# EAGLE design v6.mainboard.rpizerow (EAGLE 9.5.1)
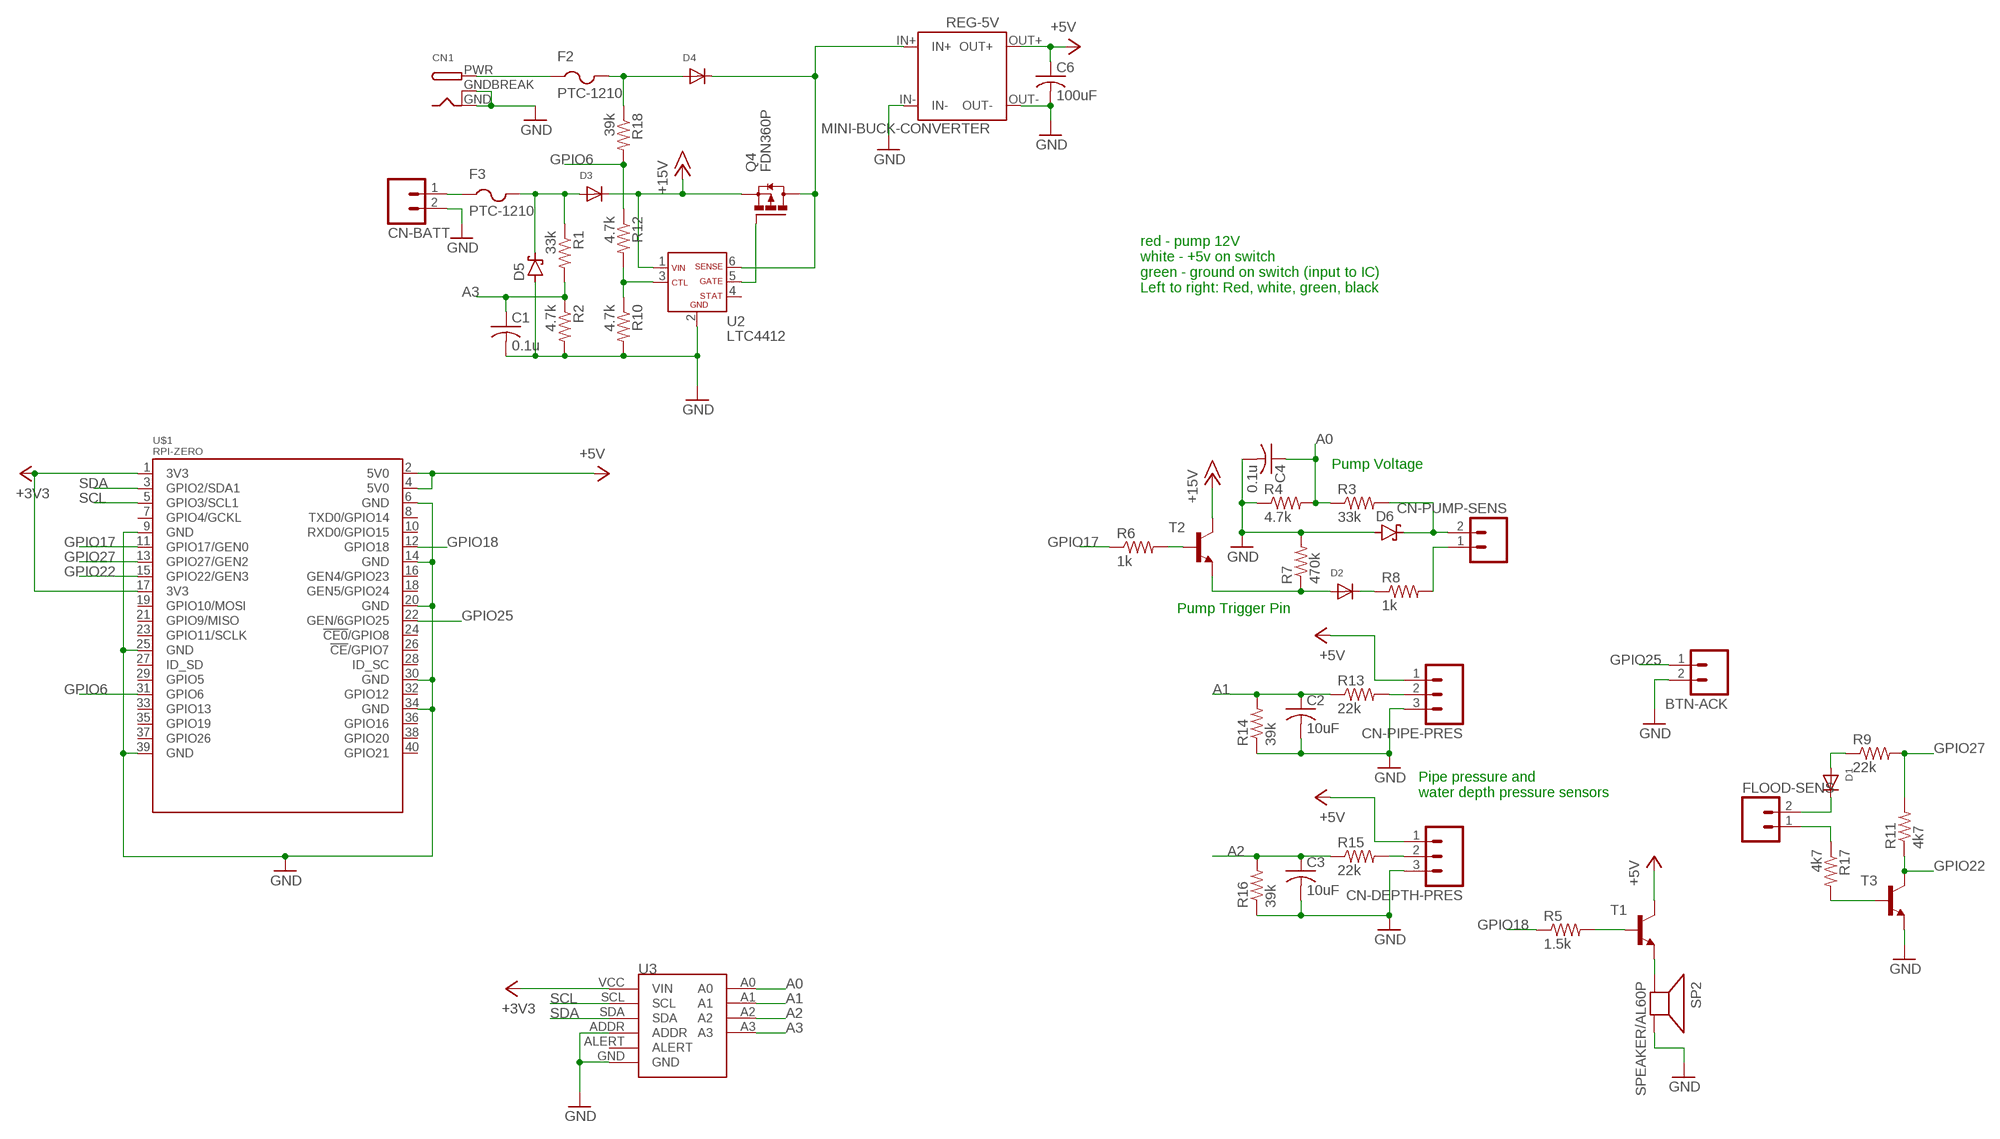
[diagram p0: schematic, sheet 1]

## Parts
BTN-ACK  M02  [02P]
C1  0.1u  C-USC0603K  [C0603K]
C2  10uF  C-USC0805K  [C0805K]
C3  10uF  C-USC0805K  [C0805K]
C4  0.1u  C-USC0603K  [C0603K]
C6  100uF  C-USC2220K  [C2220K]
CN1  DCBARRELPTH  [DCJACK_2MM_PTH]
CN-BATT  M02  [02P]
CN-DEPTH-PRES  M03  [03P]
CN-PIPE-PRES  M03  [03P]
CN-PUMP-SENS  M02  [02P]
D1  DIODESMA  [SMADIODE]
D2  DIODESMA  [SMADIODE]
D3  DIODESMA  [SMADIODE]
D4  DIODESMA  [SMADIODE]
D5  SCHOTTKY-DIODESMC  [SMC]
D6  SCHOTTKY-DIODESMC  [SMC]
F2  PTC-1210  [1210]
F3  PTC-1210  [1210]
FLOOD-SENS  M02  [02P]
Q4  FDN360P  [SUPER-SOT3]
R1  33k  R-US_R0603  [R0603]
R2  4.7k  R-US_R0603  [R0603]
R3  33k  R-US_R0603  [R0603]
R4  4.7k  R-US_R0603  [R0603]
R5  1.5k  R-US_R0603  [R0603]
R6  1k  R-US_R0603  [R0603]
R7  470k  R-US_R0603  [R0603]
R8  1k  R-US_R0603  [R0603]
R9  22k  R-US_R0603  [R0603]
R10  4.7k  R-US_R0603  [R0603]
R11  4k7  R-US_R0603  [R0603]
R12  4.7k  R-US_R0603  [R0603]
R13  22k  R-US_R0603  [R0603]
R14  39k  R-US_R0603  [R0603]
R15  22k  R-US_R0603  [R0603]
R16  39k  R-US_R0603  [R0603]
R17  4k7  R-US_R0603  [R0603]
R18  39k  R-US_R0603  [R0603]
REG-5V  MINI-BUCK-CONVERTER  [MINI-BUCK-CONVERTER]
SP2  SPEAKER/AL60P  [AL60P]
T1  BC808-NPN-SOT23-BEC  [SOT23-BEC]
T2  BC808-NPN-SOT23-BEC  [SOT23-BEC]
T3  BC808-NPN-SOT23-BEC  [SOT23-BEC]
U2  LTC4412  [SOT23-6]
U3  GY-ADS1115THM  [GY-ADS1115-THM]
U$1  RPI-ZERO  [RASPBERRYPI_BASTELSTUBE_V13_RASPI_BOARD_B+_FULL]

## Nets
+3V3: U3.VCC(VIN) U$1.1(3V3) U$1.17(3V3)
+5V: C6.1 CN-DEPTH-PRES.1 CN-PIPE-PRES.1 REG-5V.OUT+ T1.C U$1.2(5V0) U$1.4(5V0)
+15V: D3.C Q4.2(S) T2.C U2.1(VIN)
A0: C4.1 R3.1 R4.2 U3.A0
A1: C2.1 R13.1 R14.2 U3.A1
A2: C3.1 R15.1 R16.2 U3.A2
A3: C1.1 R1.2 R2.1 U3.A3
GND: BTN-ACK.2 C1.2 C2.2 C3.2 C4.2 C6.2 CN1.GND CN1.GNDBREAK CN-BATT.2 CN-DEPTH-PRES.3 CN-PIPE-PRES.3 D5.A D6.A R2.2 R4.1 R7.2 R10.2 R14.1 R16.1 REG-5V.IN- REG-5V.OUT- SP2.2(-) T3.E U2.2(GND) U3.ADDR U3.GND U$1.6(GND) U$1.9(GND) U$1.14(GND) U$1.20(GND) U$1.25(GND) U$1.30(GND) U$1.34(GND) U$1.39(GND)
GPIO6: R12.1 R18.2 U$1.31(GPIO6)
GPIO17: R6.1 U$1.11(GPIO17/GEN0)
GPIO18: R5.1 U$1.12(GPIO18)
GPIO22: R11.1 T3.C U$1.15(GPIO22/GEN3)
GPIO25: BTN-ACK.1 U$1.22(GEN/6GPIO25)
GPIO27: R9.2 R11.2 U$1.13(GPIO27/GEN2)
N$1: Q4.1(G) U2.5(GATE)
N$2: R10.1 R12.2 U2.3(CTL)
N$4: CN-PUMP-SENS.2 D6.C R3.2
N$5: D2.C R8.1
N$6: CN-PUMP-SENS.1 R8.2
N$7: CN-DEPTH-PRES.2 R15.2
N$8: R5.2 T1.B
N$9: SP2.1(+) T1.E
N$10: CN-PIPE-PRES.2 R13.2
N$11: R17.2 T3.B
N$12: R6.2 T2.B
N$13: D3.A D5.C F3.2 R1.1
N$14: D2.A R7.1 T2.E
N$15: CN-BATT.1 F3.1
N$16: D4.C Q4.3(D) REG-5V.IN+ U2.6(SENSE)
N$17: CN1.PWR F2.1
N$18: D4.A F2.2 R18.1
N$19: D1.A R9.1
N$20: FLOOD-SENS.1 R17.1
N$21: D1.C FLOOD-SENS.2
SCL: U3.SCL U$1.5(GPIO3/SCL1)
SDA: U3.SDA U$1.3(GPIO2/SDA1)
Unconnected: U2.4(STAT) U3.ALERT U$1.7(GPIO4/GCKL) U$1.8(TXD0/GPIO14) U$1.10(RXD0/GPIO15) U$1.16(GEN4/GPIO23) U$1.18(GEN5/GPIO24) U$1.19(GPIO10/MOSI) U$1.21(GPIO9/MISO) U$1.23(GPIO11/SCLK) U$1.24(!CE0!/GPIO8) U$1.26(!CE!/GPIO7) U$1.27(ID_SD) U$1.28(ID_SC) U$1.29(GPIO5) U$1.32(GPIO12) U$1.33(GPIO13) U$1.35(GPIO19) U$1.36(GPIO16) U$1.37(GPIO26) U$1.38(GPIO20) U$1.40(GPIO21)

## Notes on the sheet
- red - pump 12V
  white - +5v on switch
  green - ground on switch (input to IC)
  Left to right: Red, white, green, black
- Pump Voltage
- Pump Trigger Pin
- Pipe pressure and 
  water depth pressure sensors

## Library data of the parts
BTN-ACK CN-BATT CN-PUMP-SENS FLOOD-SENS = con-amp-quick:M02: AMP QUICK CONNECTOR; OC_FARNELL: unknown; OC_NEWARK: unknown
C1-C4 C6 = adafruit:C-US: CAPACITOR, American symbol
CN1 = adafruit:DCBARREL: 2.0mm DC Barrel Jack DCJACK_2MM_PTH - Through Hole Jack (4UConnector: 05537)
CN-DEPTH-PRES CN-PIPE-PRES = con-amp-quick:M03: AMP QUICK CONNECTOR; OC_FARNELL: unknown; OC_NEWARK: unknown
D1-D4 = adafruit:DIODE: Diode SMADIODE - SMA Surface Mount Package 20V 1A Schottky Diode Digikey: 641-1014-6-ND DO-1N4148 - Through Hole Small Current Diode SOD-123 20V 1 A (.5mV Vf) Schottky Diode - Digikey: MBRX120TPMSCT-ND SOD-323 10V 570mA (.38mV Vf, 3ns) Schottky Diode - Digikey: ZLLS410CT-ND SOD-523 30V 30mA Schottky Diode (RB751S-40TE61) - Digikey: RB751S-40TE61CT-ND SOT23-R/W - SOT23 Package (R = Solder Paste/Reflow Ovens, W = Hand-Soldering) BAT54Film 40V 300mA - Digikey: 497-7162-1-ND
D5 D6 = diode:SCHOTTKY-DIODE: Schottky Diode
F2 F3 = serge:PTC-1210
Q4 = transistor-power:FDN360P: Single P-Channel, PowerTrench (R) MOSFET Source: http://www.fairchildsemi.com/ds/FD/FDN360P.pdf
R1-R18 = adafruit:R-US_: RESISTOR, American symbol
REG-5V = serge:MINI-BUCK-CONVERTER
SP2 = adafruit:SPEAKER: SPEAKER Source: Buerklin Added PS12 (for part # PS1240 piezo) http://www.ladyada.net/library/pcb/eaglelibrary.html
T1-T3 = transistor:*-NPN-: NPN Transistror BF959 corrected 2008.03.06
U2 = U-LT-LTC4412-ideal-diode:LTC4412
U3 = serge:GY-ADS1115
U$1 = RPI-Zero-wh:RPI-ZERO

## Board
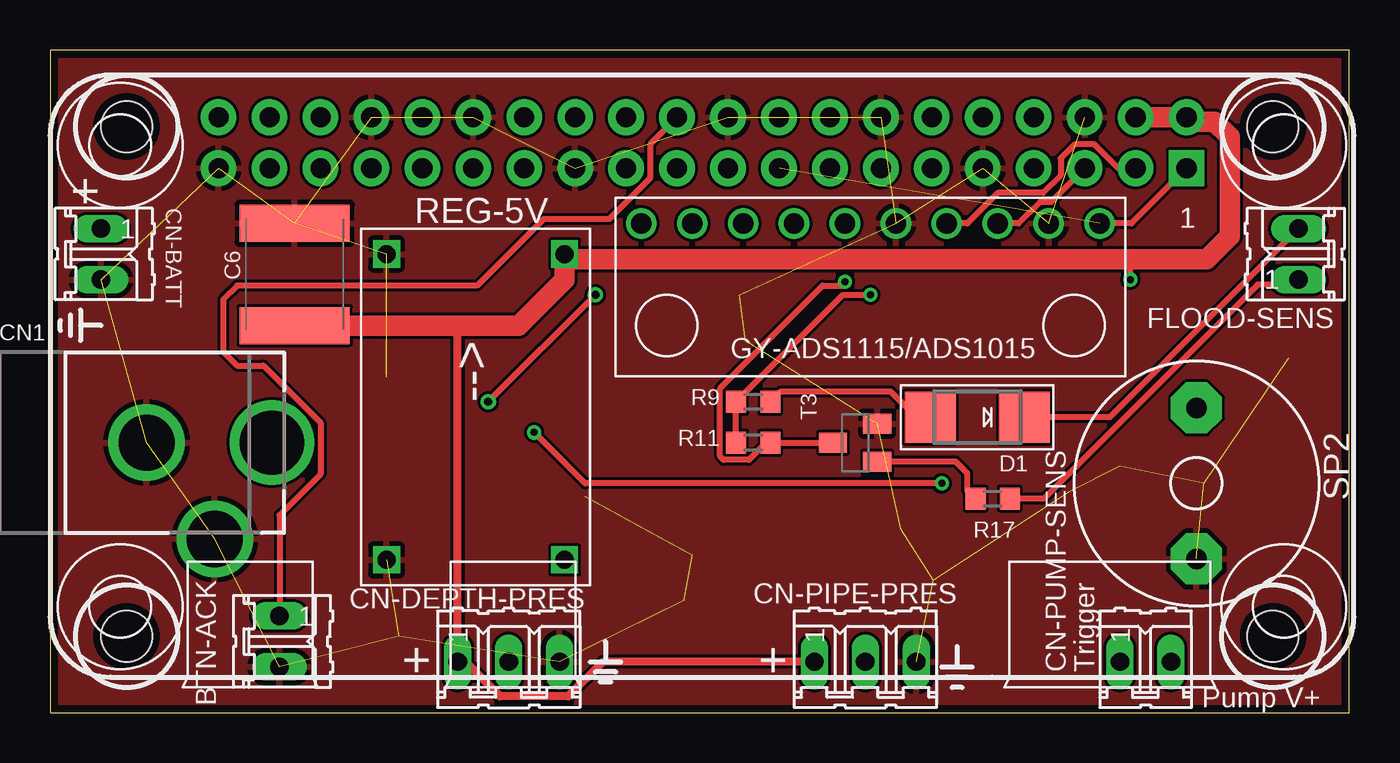
[diagram p1: board, top side]
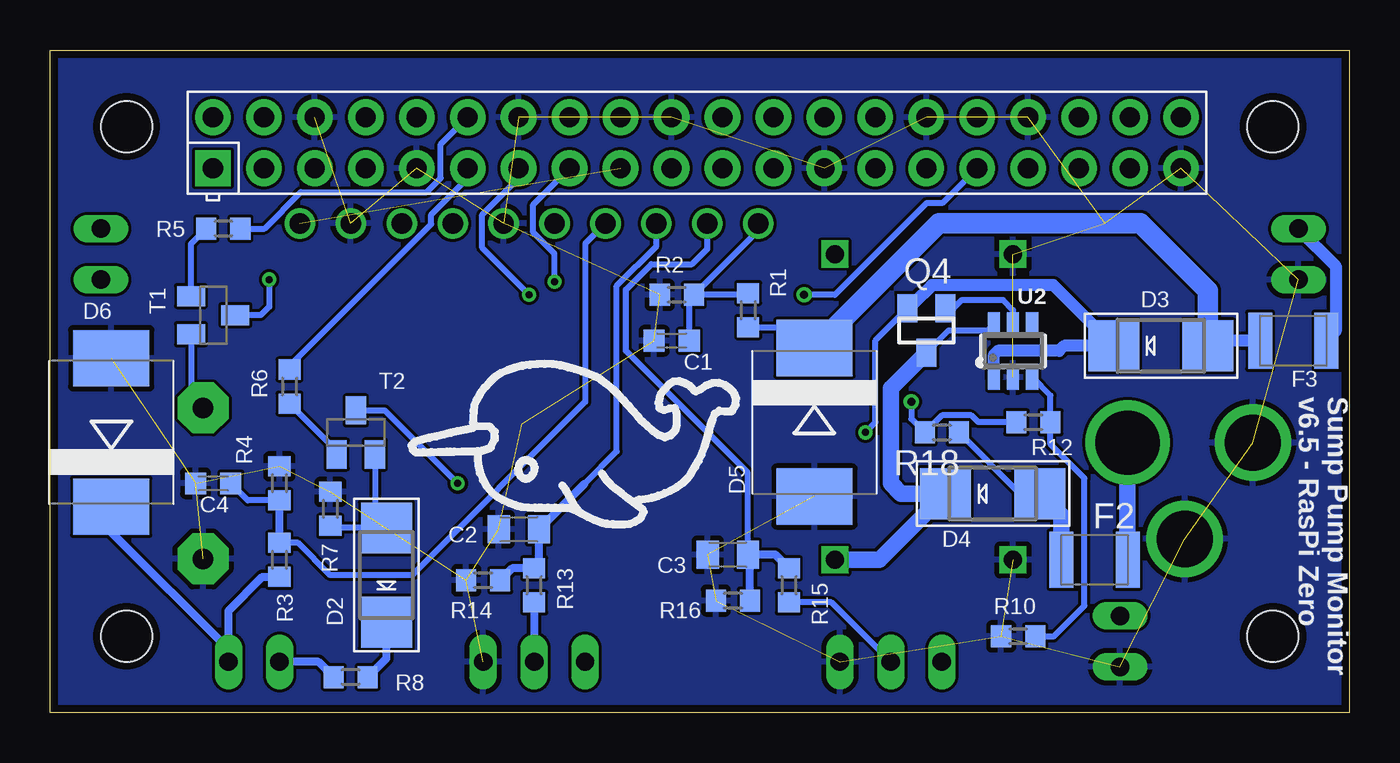
[diagram p2: board, bottom side, seen from below]

Size 64.77 x 33.02 mm. Coordinates in mm from the lower left corner, seen from the top.
Outline: 0,0 64.77,0 64.77,33.02 0,33.02 0,0
Copper layers (1*16): Top 0.0356mm / dielectric 1.5011mm / Bottom 0.0356mm
Design rules "LaenPCBOrder": minimum track width 6mil, minimum drill 13mil, track to track 6mil, track to pad 6mil, pad to pad 6mil, via to via 6mil, smd to smd 6mil, copper to edge 15mil, drill to drill 6mil, minimum pad ring 7mil, minimum via ring 7mil, stop-mask expansion 4mil, vias tented up to drill 0mil, thermal gap 10mil
Holes 2.54 mm at 3.81,3.81 60.96,3.81 60.96,29.21 3.81,29.21

### Footprints (pad centres in the part's own frame; a part is rotated, then mirrored left to right if it is on the bottom)
02P = drill 0.914 long: 1 -1.27,0; 2 1.27,0
C0603K = smd 1.05 x 1.08: 1 -0.875,0; 2 0.875,0
C0805K = smd 1.1 x 1.4: 1 -1,0; 2 1,0
C2220K = smd 1.85 x 5.5: 1 -2.55,0; 2 2.55,0
DCJACK_2MM_PTH = drill 2.8: GND 0,7.35; GNDBREAK 4.8,10.75 | drill 3.2: PWR 0,13.6
03P = drill 0.914 long: 1 -2.54,0; 2 0,0; 3 2.54,0
SMADIODE = smd 2.54 x 2.54: A 2.349,0; C -2.349,0
SMC = smd 2.8 x 3.8: A 3.7,0; C -3.7,0
1210 = smd 1.2 x 2.8: 1 -1.65,0; 2 1.65,0
SUPER-SOT3 = smd 1 x 1.4: 1 -0.95,-1.1; 2 0.95,-1.1; 3 0,1.1
R0603 = smd 1 x 1.1: 1 -0.85,0; 2 0.85,0
MINI-BUCK-CONVERTER = drill 0.9 square: IN+ 10.16,1.27; IN- 1.27,1.27; OUT+ 10.16,16.51; OUT- 1.27,16.51
AL60P = drill 1.016 pad 2.54 octagon: 1 -3.759,0; 2 3.759,0
SOT23-BEC = smd 1 x 1.4: B -0.95,-1.1; C 0,1.1; E 0.95,-1.1
SOT23-6 = smd 0.6 x 1.25: 1 0.95,1.31; 2 0,1.31; 3 -0.95,1.31; 4 -0.95,-1.31; 5 0,-1.31; 6 0.95,-1.31
GY-ADS1115-THM = drill 1.016: A0 -3.81,0; A1 -6.35,0; A2 -8.89,0; A3 -11.43,0; ADDR 1.27,0; ALERT -1.27,0; GND 8.89,0; SCL 6.35,0; SDA 3.81,0; VCC 11.43,0
RASPBERRYPI_BASTELSTUBE_V13_RASPI_BOARD_B+_FULL = drill 1 pad 1.778 square: 1 56.654,25.357 | drill 1 pad 1.778: 2 56.654,27.897; 3 54.114,25.357; 4 54.114,27.897; 5 51.574,25.357; 6 51.574,27.897; 7 49.034,25.357; 8 49.034,27.897; 9 46.494,25.357; 10 46.494,27.897; 11 43.954,25.357; 12 43.954,27.897; 13 41.414,25.357; 14 41.414,27.897; 15 38.874,25.357; 16 38.874,27.897; 17 36.334,25.357; 18 36.334,27.897; 19 33.794,25.357; 20 33.794,27.897; 21 31.254,25.357; 22 31.254,27.897; 23 28.714,25.357; 24 28.714,27.897; 25 26.174,25.357; 26 26.174,27.897; 27 23.634,25.357; 28 23.634,27.897; 29 21.094,25.357; 30 21.094,27.897; 31 18.554,25.357; 32 18.554,27.897; 33 16.014,25.357; 34 16.014,27.897; 35 13.474,25.357; 36 13.474,27.897; 37 10.934,25.357; 38 10.934,27.897; 39 8.394,25.357; 40 8.394,27.897

### Placement (x,y rotation side)
BTN-ACK  11.43,3.56 270 top
C1  33.78,18.54 180 bottom
C2  41.4,9.14 180 bottom
C3  30.99,7.87 180 bottom
C4  56.64,11.43 180 bottom
C6  12.19,21.84 90 top
CN1  -2.54,13.46 270 top
CN-BATT  2.54,22.86 270 top
CN-DEPTH-PRES  22.86,2.54 0 top
CN-PIPE-PRES  40.64,2.54 0 top
CN-PUMP-SENS  54.61,2.54 0 top
D1  46.23,14.73 180 top
D2  48.01,6.86 90 bottom
D3  9.4,18.29 0 bottom
D4  17.78,10.92 0 bottom
D5  26.67,14.48 270 bottom
D6  61.72,13.97 90 bottom
F2  12.7,7.62 180 bottom
F3  2.79,18.54 180 bottom
FLOOD-SENS  62.23,22.86 90 top
Q4  21.08,19.05 180 bottom
R1  29.97,20.07 90 bottom
R2  33.53,20.83 180 bottom
R3  53.34,7.62 270 bottom
R4  53.34,11.43 270 bottom
R5  56.13,24.13 180 bottom
R6  52.83,16.26 270 bottom
R7  50.8,10.16 90 bottom
R8  49.78,1.78 180 bottom
R9  35.05,15.49 180 top
R10  16.51,3.81 180 bottom
R11  35.05,13.46 180 top
R12  15.75,14.48 0 bottom
R13  40.64,6.35 270 bottom
R14  43.18,6.6 0 bottom
R15  27.94,6.35 270 bottom
R16  30.73,5.59 0 bottom
R17  46.99,10.67 180 top
R18  20.32,13.97 180 bottom
REG-5V  15.49,6.35 0 top
SP2  57.15,11.43 270 top
T1  56.64,19.81 270 bottom
T2  49.53,13.97 0 bottom
T3  40.13,13.46 90 top
U2  16.76,18.03 180 bottom
U3  40.89,24.38 0 top
U$1  0,1.78 0 top

### Tracks (layer width: path | path; a pad name or v marks a point on that pad's centre or on a via)
+3V3  (1 unrouted)
  Top 0.305: U$1.1 53.9,24.38 U3.VCC
  Bottom 0.305: 52.67,24.04 U3.VCC
+5V  (via drill 0.35)
  Top 0.305: v53.85,21.59 53.85,22.61
  Top 0.4: CN-PIPE-PRES.1 27.55,2.54 25.83,0.82 22.43,0.82 20.71,2.54 CN-DEPTH-PRES.1
  Top 0.406: CN-DEPTH-PRES.1 20.32,19.29
  Top 1.016: C6.1 20.32,19.29 23.36,19.29 25.65,21.59 REG-5V.OUT+ 25.91,22.61 53.85,22.61 57.66,22.61 58.8,23.75 58.8,28.7 58.04,29.46 56.87,29.46 U$1.2 U$1.4
  Bottom 0.305: v53.85,21.59 53.85,20.23 54.27,19.81 T1.C
+15V  (via drill 0.35)
  Top 0.305: v44.45,11.43 26.67,11.43 v24.13,13.97
  Bottom 0.305: T2.C 48.09,15.07 v44.45,11.43 | v24.13,13.97 23.62,14.48 23.62,18.56 Q4.2 21.98,20.15 21.7,20.43
  Bottom 0.61: 21.7,20.43 20.82,21.31 14.77,21.31 D3.C 14.22,18.29 14.48,18.03 17.53,18.03 17.71,17.85 U2.1
A0
  Bottom 0.305: U3.A0 38.1,23.37 38.1,15.49 46.74,6.86 50.8,6.86 52.41,8.47 R3.1 | R4.2 54.92,10.58 C4.1
  Bottom 0.406: R3.1 R4.2
A1
  Bottom 0.305: U3.A1 34.54,23.25 36.52,21.27 36.52,13.02 38.14,11.41
  Bottom 0.406: R14.2 41.73,7.2 R13.1 40.4,7.44 C2.1 38.14,11.41
A2
  Bottom 0.305: C3.1 29.99,11.95 36.07,18.03 36.07,21.08 34.8,22.35 32.77,22.35 32,23.11 U3.A2
  Bottom 0.406: R15.1 28.61,7.87 C3.1 29.88,7.77 R16.2
A3
  Bottom 0.305: R2.1 30.06,20.83 R1.2 | R2.1 29.46,24.04 U3.A3 | C1.1 32.91,20.6 R2.1
GND  (33 unrouted)
  pour Top: 0,33.02 64.77,33.02 64.77,0 0,0
  pour Bottom: 0,33.02 64.77,33.02 64.77,0 0,0
GPIO6  (via drill 0.4)
  Top 0.305: v27.18,20.83 v21.84,15.49
  Bottom 0.305: R12.1 18.5,14.48 18.84,14.82 20.32,14.82 R18.2 21.84,14.64 v21.84,15.49 | U$1.31 20.29,25.4 21.08,25.4 25.65,20.83 v27.18,20.83
GPIO17
  Bottom 0.305: R6.1 52.83,17.29 45.77,24.35 45.77,24.83 43.95,26.64 U$1.11
GPIO18
  Bottom 0.305: R5.1 54.09,24.13 52.27,25.94 46,25.94 45.3,26.64 45.3,28.33 U$1.12
GPIO22  (via drill 0.35)
  Top 0.305: T3.C R11.1 35.68,13.46 34.83,12.61 33.58,12.61 33.4,12.79 33.4,16.17 38.51,21.29 39.57,21.29 39.62,21.34 v39.62,21.49
  Bottom 0.305: v39.62,21.49 39.62,22.88 40.69,23.94 40.69,25.32 U$1.15
GPIO25
  Top 0.305: BTN-ACK.1 11.43,9.85 13.47,11.89 13.47,14.46 10.63,17.3 9.32,17.3 8.63,17.99 8.63,20.6 9.32,21.29 21.28,21.29 24.6,24.6 27.87,24.6 29.91,26.64 29.91,28.33 U$1.22
GPIO27  (via drill 0.35)
  Top 0.305: R11.2 R9.2 39.54,20.83 v40.89,20.83
  Bottom 0.305: U$1.13 41.41,26.64 43.23,24.83 43.23,23.16 v40.89,20.83
N$1
  Bottom 0.305: Q4.1 19.73,20.15 19.3,20.57 17.27,20.57 16.76,20.07 U2.5
N$2
  Bottom 0.305: R10.1 14.73,3.81 13.21,5.33 13.21,11.68 14.9,13.37 R12.2 14.9,15.81 U2.3
N$4
  Bottom 0.406: R3.2 54.19,6.77 55.88,5.08 CN-PUMP-SENS.2 55.88,3.16 61.72,9 D6.C
N$5
  Bottom 0.406: R8.1 48.01,2.71 D2.C
N$6
  Bottom 0.406: R8.2 51.4,2.54 CN-PUMP-SENS.1
N$7
  Bottom 0.305: CN-DEPTH-PRES.2 25.82,5.5 R15.2
N$8
  Bottom 0.305: T1.B 57.74,23.37 R5.2
N$9
  Bottom 0.305: T1.E 57.74,15.78 SP2.1
N$10
  Bottom 0.406: R13.2 CN-PIPE-PRES.2
N$11
  Top 0.305: R17.2 45.72,11.09 45.72,11.94 45.15,12.51 T3.B
N$12
  Bottom 0.305: R6.2 50.48,13.05 T2.B
N$13
  Bottom 0.305: R1.1 27.71,19.22 D5.C
  Bottom 0.61: F3.2 6.79,18.54 D3.A
  Bottom 1.016: D5.C 20.46,24.38 10.41,24.38 7.05,21.02 D3.A
N$14
  Bottom 0.305: D2.A 48.26,9.21 | 48.26,9.21 50.7,9.21 | T2.E 48.58,9.53 48.26,9.21
  Bottom 0.406: 50.7,9.21 R7.1
N$15
  Bottom 0.61: CN-BATT.1 0.69,22.28 0.69,19 F3.1
N$16
  Bottom 0.305: Q4.3 19.98,19.05 18.01,19.05 U2.6
  Bottom 0.813: REG-5V.IN+ 23.43,7.62 D4.C 22.35,10.92 22.86,11.43 22.86,16.17 Q4.3
N$17
  Bottom 0.813: CN1.PWR F2.1
N$18
  Bottom 0.305: R18.1 16.42,10.92 D4.A
  Bottom 0.813: F2.2 14.35,9.84 D4.A
N$19
  Top 0.305: D1.A 43.18,14.73 41.91,16 36.41,16 R9.1
N$20
  Top 0.305: FLOOD-SENS.1 61.98,21.34 60.2,21.34 49.53,10.67 R17.1
N$21
  Top 0.305: FLOOD-SENS.2 52.83,14.73 D1.C
SCL
  Top 0.305: U$1.5 49.89,25.45 49.34,25.45 48.27,24.38 U3.SCL
SDA
  Top 0.305: U3.SDA 45.73,24.38 47.26,25.91 49.49,25.91 50.38,26.79 50.38,27.63 51.08,28.33 52.07,28.33 53.26,27.14 U$1.3

### Text on the board
tPlace: + | + | + | Trigger | Pump V+
bPlace: Sump Pump Monitor / v6.5 - RasPi Zero
tNames: -->